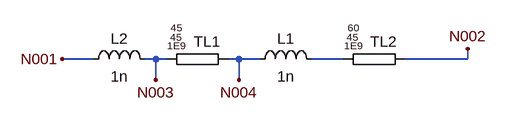
[diagram p0: schematic LineaTransmision.asc]
LineaTransmision.asc, the LTspice schematic file:
Version 4
SHEET 1 880 680
WIRE 64 160 16 160
WIRE 160 160 144 160
WIRE 176 160 160 160
WIRE 288 160 272 160
WIRE 320 160 288 160
WIRE 448 160 400 160
WIRE 640 160 640 144
WIRE 640 160 544 160
WIRE 160 192 160 160
WIRE 288 192 288 160
FLAG 16 160 N001
FLAG 640 144 N002
FLAG 160 192 N003
FLAG 288 192 N004
SYMBOL ind 304 176 R270
WINDOW 0 32 56 VTop 2
WINDOW 3 5 56 VBottom 2
SYMATTR InstName L1
SYMATTR Value 1n
SYMBOL TL 224 160 R0
SYMATTR SpiceModel 45
SYMATTR Value 45
SYMATTR Value2 1E9
SYMATTR InstName TL1
SYMBOL ind 48 176 R270
WINDOW 0 32 56 VTop 2
WINDOW 3 5 56 VBottom 2
SYMATTR InstName L2
SYMATTR Value 1n
SYMBOL TL 496 160 R0
SYMATTR SpiceModel 60
SYMATTR Value 45
SYMATTR Value2 1E9
SYMATTR InstName TL2

The netlist it stands for:
* LineaTransmision.asc
L1 N004 N005 1n
TL1 N003 N004 45 45 1E9
L2 N001 N003 1n
TL2 N005 N002 60 45 1E9
.backanno
.end